# Altium schematic sheet Power_managment.SchDoc: Power Management
size A4; Author: Ph.A; SheetNumber: 5; SheetTotal: 6
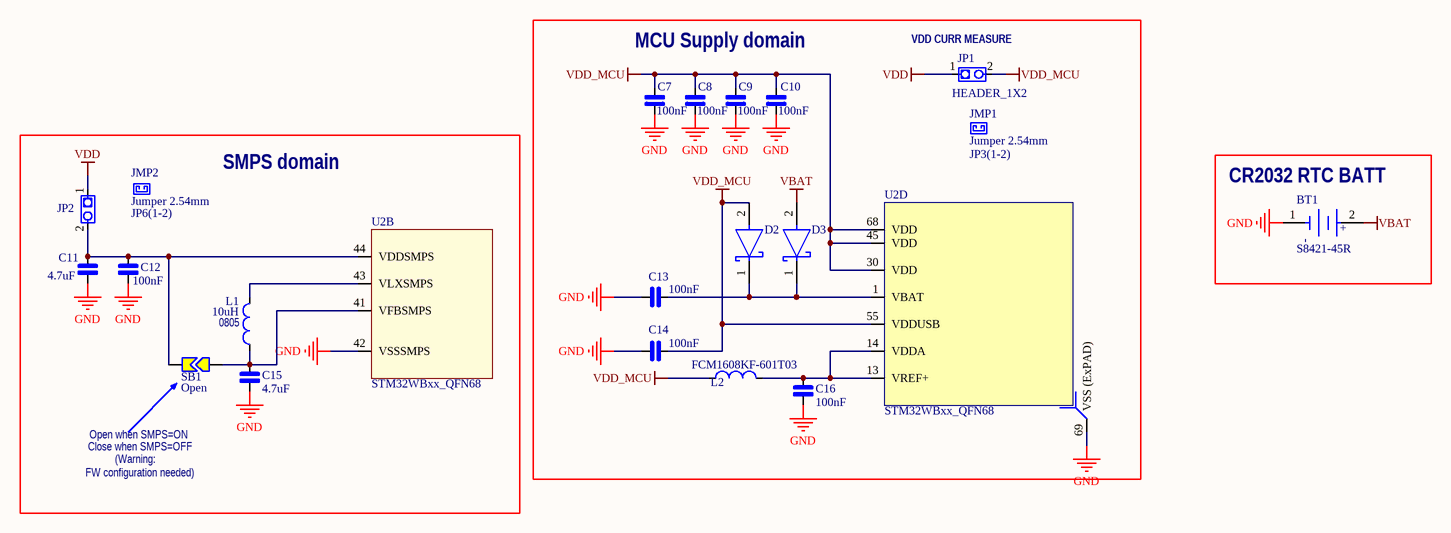
[diagram p0: Power_managment.SchDoc]

## Parts
BT1  S8421-45R  [FP-S8421-45R-MFG]
C7  100nF  [C1206]
C8  100nF  [C1206]
C9  100nF  [C1206]
C10  100nF  [C1206]
C11  4.7uF  [C1206]
C12  100nF  [C1206]
C13  100nF  [C1206]
C14  100nF  [C1206]
C15  4.7uF  [C1206]
C16  100nF  [C1206]
D2  LS4148-GS18  [FP-6_560-5006_01-4-MFG]  (value not drawn)
D3  LS4148-GS18  [FP-6_560-5006_01-4-MFG]  (value not drawn)
JMP1  Jumper 2.54mm  default: JP3(1-2)  [Jumper 2.54mm BLACK]
JMP2  Jumper 2.54mm  default: JP6(1-2)  [Jumper 2.54mm BLACK]
JP1  HEADER_1X2  [Header M 1x2x2.54 TH V]
JP2  HEADER_1X2  [GP_2x1_2mm]  (value not drawn)
L1  10uH  [0805_COIL]
L2  FCM1608KF-601T03  [0603_COIL]
SB1  Open  [SB-tiny]
U2  STM32WBxx_QFN68  [VFQFPN68_8x8x0.1_p0.4]  (parts B,D of 5)

## Blocks framed on the sheet
MCU Supply domain: C7-C10 C13 C14 C16 D2 D3 JMP1 JP1 L2 U2
SMPS domain: C11 C12 C15 JMP2 JP2 L1 SB1 U2
CR2032 RTC BATT: BT1

## Nets
GND: BT1.1(C) C7.2 C8.2 C9.2 C10.2 C11.2 C12.2 C13.2 C14.2 C15.2 C16.2 U2.42(VSSSMPS) U2.69(VSS_(ExPAD))
VBAT: BT1.2(A) D3.2(A)
VDD: JP1.1 JP2.1
VDD_MCU: C7.1 C8.1 C9.1 C10.1 C14.1 D2.2(A) JP1.2 L2.1 U2.30(VDD) U2.45(VDD) U2.55(VDDUSB) U2.68(VDD)
NetC11_1: C11.1 C12.1 JP2.2 SB1.2 U2.44(VDDSMPS)
NetC13_1: C13.1 D2.1(C) D3.1(C) U2.1(VBAT)
NetC15_1: C15.1 L1.1 SB1.1 U2.41(VFBSMPS)
NetC16_1: C16.1 L2.2 U2.13(VREF+) U2.14(VDDA)
NetL1_2: L1.2 U2.43(VLXSMPS)

## Notes on the sheet
- (near JP1) VDD CURR MEASURE
- (near L1) 0805
- FW configuration needed)
- Close when SMPS=OFF
- Open when SMPS=ON
- (Warning:
- Title:
- Project:
- Size:
- Revision:
- Variant:
- A4
- -
- Date:
- Reference:
- Sheet:
- of
- (in symbol CMP-2000-07028-3) +; -

## Library data of the parts
BT1 = CMP-2000-07028-3: BATTERY HOLDER COIN 20MM SMD; Number of Cells: 1; Min Operating Temperature: -40°C; Packaging: Tape and Reel; Max Operating Temperature: 105°C; Number of Batteries: 1; Package Quantity: 500; Material: Polyphenylene; Case/Package: SMD/SMT; Mount: Surface Mount; REACH SVHC: No SVHC; Contact Plating: Bronze; Termination: SMD/SMT
C7-C16 = CAP_NPOL: Capacitor_not polarized
D2 D3 = CMP-02539-000014-1: DIODE GEN PURP 75V 150MA SOD80; Manufacturer: Vishay; Capacitance: 4pF; Max Surge Forward Current: 2A; Forward Current: 300mA; Max Repetitive Reverse Voltage: 100V; Max Junction Temp: +175°C; Peak Reverse Current: 5uA; Value: 4pF; Automotive Grade: Grade 0; Device Class L2: Diodes; Digikey Description: DIODE GEN PURP 75V 150MA SOD80; Lead Free: Yes; Device Class L1: Discrete Semiconductors; Mouser Description: In a Pack of 100, Vishay Switching Diode, 300mA 75V, 2-Pin SOD-80 LS4148-GS18; Package: 6.560-5006.01-4; RoHS: TRUE; Temperature Range High: +175°C; ComponentLink2URL: http://www.vishay.com/docs/85561/ls4148.pdf; Temperature: to +175°C; Manufacturer Part Number: LS4148-GS18; Device Class L3: Schottky Diodes; Automotive: Yes; ComponentLink2Description: Datasheet; Reverse Voltage: 75V; Height: 1.7mm; Category: Diode; Octopart: https://octopart.com/ls4148-gs18-vishay-55507867
JP1 JP2 = HEADER_1X2_L
L1 = IND_74479777310A: Coil Wurtz 10uH ref: 74479777310A
L2 = IND_FCM1608KF-601T03
SB1 = Strap2: Solder Jumper; Solder: YES; Published: 24-Mar-1999; Revision: July-2002: Re-released for DXP Platform.; Publisher: Altium Limited